# EAGLE design Atmega project_v2 (EAGLE 9.6.2)
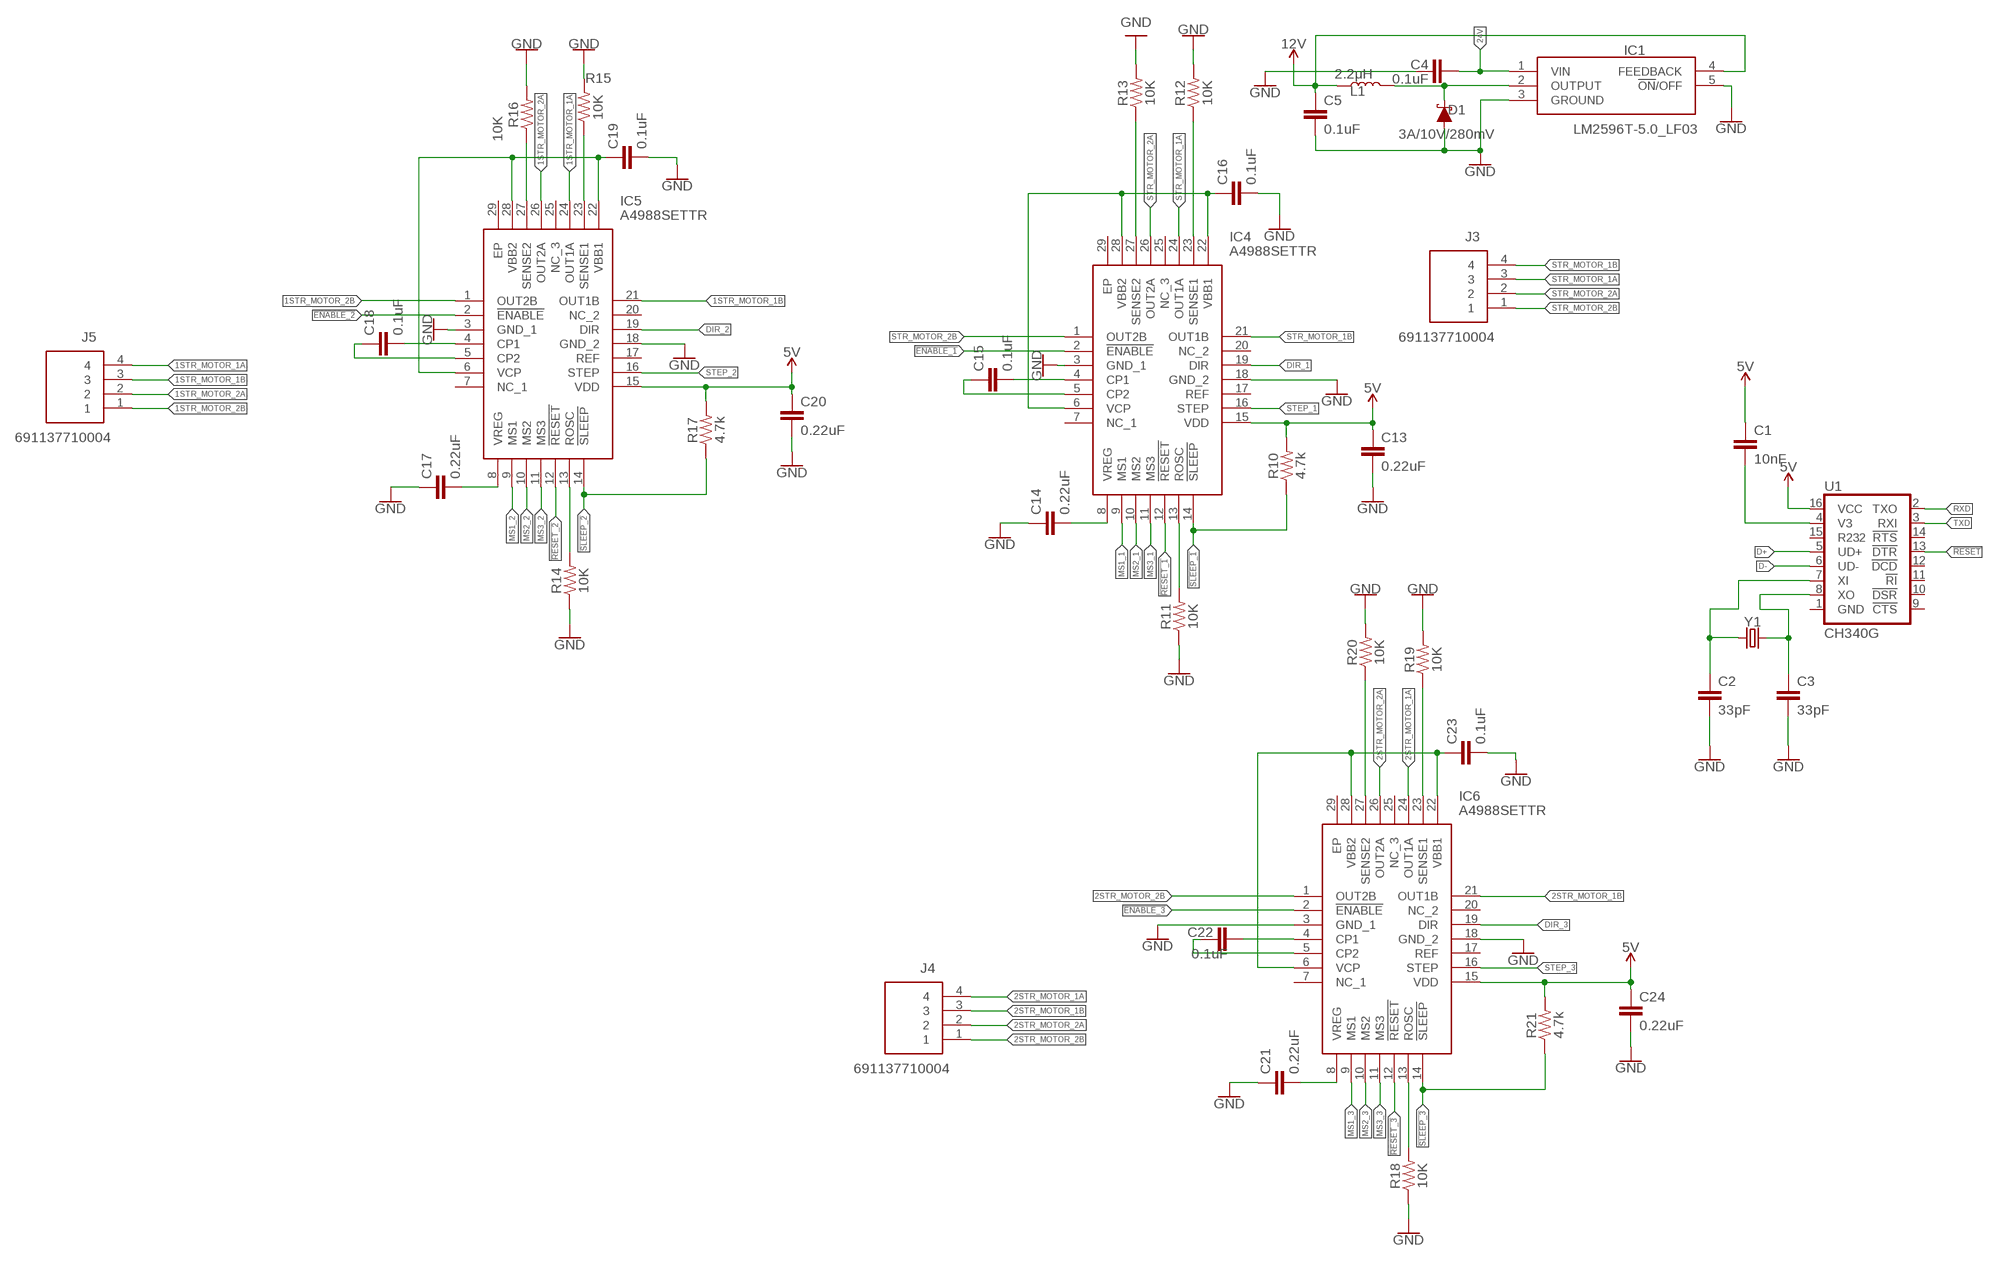
[diagram p0: schematic, sheet 1, part 1 of 2]
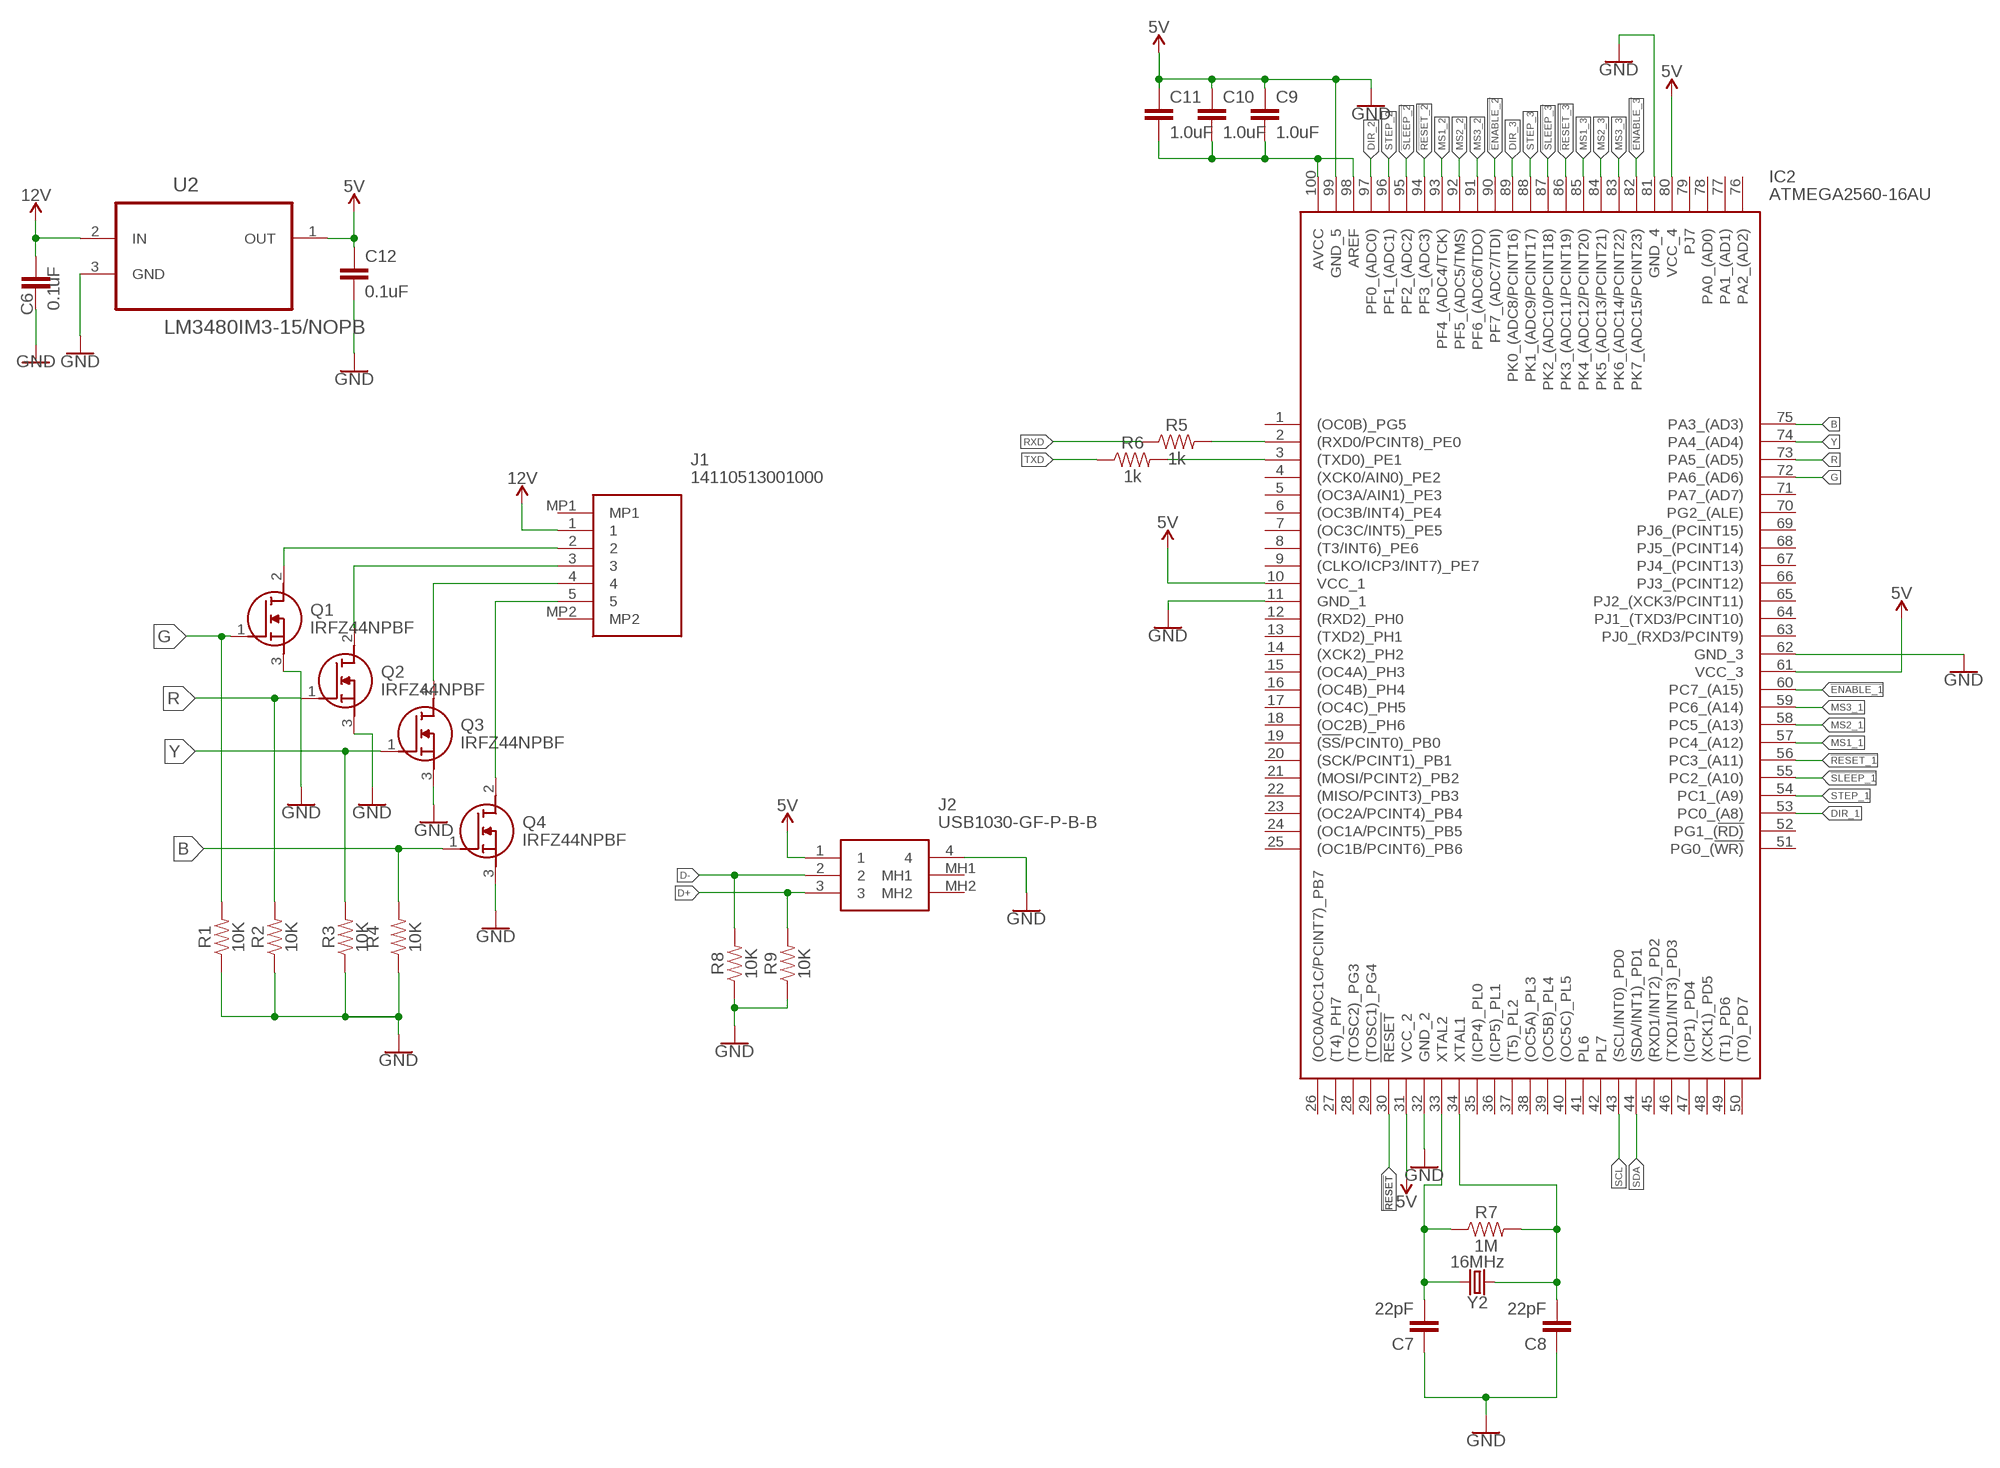
[diagram p1: schematic, sheet 1, part 2 of 2]

## Parts
C1  10nF  10NF-0402T-25V-10%  [0402-TIGHT]
C2  33pF  33PF-0402T-50V-5%  [0402-TIGHT]
C3  33pF  33PF-0402T-50V-5%  [0402-TIGHT]
C4  0.1uF  0.1UF-0603-25V-5%  [0603]
C5  0.1uF  0.1UF-0402T-16V-10%  [0402-TIGHT]
C6  0.1uF  0.1UF-0402T-16V-10%  [0402-TIGHT]
C7  22pF  22PF-0402T-16V-10%  [0402-TIGHT]
C8  22pF  22PF-0402T-16V-10%  [0402-TIGHT]
C9  1.0uF  1.0UF-0402T-16V-10%  [0402-TIGHT]
C10  1.0uF  1.0UF-0402T-16V-10%  [0402-TIGHT]
C11  1.0uF  1.0UF-0402T-16V-10%  [0402-TIGHT]
C12  0.1uF  0.1UF-0402T-6.3V-10%-X7R  [0402-TIGHT]
C13  0.22uF  0.22UF-0402T-10V-10%  [0402-TIGHT]
C14  0.22uF  0.22UF-0402T-10V-10%  [0402-TIGHT]
C15  0.1uF  0.1UF-0402T-10V-10%-X7R  [0402-TIGHT]
C16  0.1uF  0.1UF-0402T-10V-10%-X7R  [0402-TIGHT]
C17  0.22uF  0.22UF-0402T-10V-10%  [0402-TIGHT]
C18  0.1uF  0.1UF-0402T-10V-10%-X7R  [0402-TIGHT]
C19  0.1uF  0.1UF-0402T-10V-10%-X7R  [0402-TIGHT]
C20  0.22uF  0.22UF-0402T-10V-10%  [0402-TIGHT]
C21  0.22uF  0.22UF-0402T-10V-10%  [0402-TIGHT]
C22  0.1uF  0.1UF-0402T-10V-10%-X7R  [0402-TIGHT]
C23  0.1uF  0.1UF-0402T-10V-10%-X7R  [0402-TIGHT]
C24  0.22uF  0.22UF-0402T-10V-10%  [0402-TIGHT]
D1  3A/10V/280mV  DIODE-SCHOTTKY-BAT60A  [SOD-323]
IC1  LM2596T-5.0_LF03  [TO170P470X1028X2142-5P]
IC2  ATMEGA2560-16AU  [QFP50P1600X1600X120-100N]
IC4  A4988SETTR  [QFN50P500X500X100-29N]
IC5  A4988SETTR  [QFN50P500X500X100-29N]
IC6  A4988SETTR  [QFN50P500X500X100-29N]
J1  14110513001000  [14110513001000]
J2  USB1030-GF-P-B-B  [USB1030GFPBB]
J3  691137710004  [691137710004]
J4  691137710004  [691137710004]
J5  691137710004  [691137710004]
L1  2.2μH  2.2μH-0805_WIDE-2.2μH-1.7A-0.14OHM  [0805-WIDE]
Q1  IRFZ44NPBF  [TO254P483X1016X1994-3P]
Q2  IRFZ44NPBF  [TO254P483X1016X1994-3P]
Q3  IRFZ44NPBF  [TO254P483X1016X1994-3P]
Q4  IRFZ44NPBF  [TO254P483X1016X1994-3P]
R1  10K  10KOHM-0402-1/10W-0.1%  [0402-TIGHT]
R2  10K  10KOHM-0402-1/10W-0.1%  [0402-TIGHT]
R3  10K  10KOHM-0402-1/10W-0.1%  [0402-TIGHT]
R4  10K  10KOHM-0402-1/10W-0.1%  [0402-TIGHT]
R5  1k  1KOHM-0402T-1/16W-1%  [0402-TIGHT]
R6  1k  1KOHM-0402T-1/16W-1%  [0402-TIGHT]
R7  1M  1MOHM-0402T-1/16W-5%  [0402-TIGHT]
R8  10K  10KOHM-0402-1/10W-0.1%  [0402-TIGHT]
R9  10K  10KOHM-0402-1/10W-0.1%  [0402-TIGHT]
R10  4.7k  4.7KOHM-0402T-1/16W-1%  [0402-TIGHT]
R11  10K  10KOHM-0402-1/10W-0.1%  [0402-TIGHT]
R12  10K  10KOHM-0402-1/10W-0.1%  [0402-TIGHT]
R13  10K  10KOHM-0402-1/10W-0.1%  [0402-TIGHT]
R14  10K  10KOHM-0402-1/10W-0.1%  [0402-TIGHT]
R15  10K  10KOHM-0402-1/10W-0.1%  [0402-TIGHT]
R16  10K  10KOHM-0402-1/10W-0.1%  [0402-TIGHT]
R17  4.7k  4.7KOHM-0402T-1/16W-1%  [0402-TIGHT]
R18  10K  10KOHM-0402-1/10W-0.1%  [0402-TIGHT]
R19  10K  10KOHM-0402-1/10W-0.1%  [0402-TIGHT]
R20  10K  10KOHM-0402-1/10W-0.1%  [0402-TIGHT]
R21  4.7k  4.7KOHM-0402T-1/16W-1%  [0402-TIGHT]
U1  CH340G  CH340GSMD  [SO016]
U2  LM3480IM3-15/NOPB  [SOT95P251X112-3N]
Y1  CRYSTAL-12MHZ  [CRYSTAL-SMD-2X2.5MM]
Y2  16MHz  CRYSTAL-16MHZSMD-5X3.2  [CRYSTAL-SMD-5X3.2-4PAD]

## Nets
1STR_MOTOR_1A: IC5.24(OUT1A) J5.4
1STR_MOTOR_1B: J5.3
1STR_MOTOR_2A: IC5.26(OUT2A) J5.2
1STR_MOTOR_2B: IC5.1(OUT2B) J5.1
2STR_MOTOR_1A: IC6.24(OUT1A) J4.4
2STR_MOTOR_1B: J4.3
2STR_MOTOR_2A: IC6.26(OUT2A) J4.2
2STR_MOTOR_2B: IC6.1(OUT2B) J4.1
5V: C1.1 C9.1 C10.1 C11.1 C12.1 C13.1 C20.1 C24.1 IC2.10(VCC_1) IC2.31(VCC_2) IC2.61(VCC_3) IC2.80(VCC_4) IC2.99(GND_5) IC4.15(VDD) J2.1 R10.2 R17.2 R21.2 U1.16(VCC) U2.1(OUT) ; supply symbol labelled GND
5V1: IC5.15(VDD)
5V2: IC6.15(VDD)
12V: C5.1 C6.2 IC1.4(FEEDBACK) J1.1 L1.1 U2.2(IN)
24V: C4.2 IC1.1(VIN)
!ENABLE_1: IC2.60(PC7_(A15)) IC4.2(!ENABLE)
!ENABLE_2: IC2.90(PF7_(ADC7/TDI)) IC5.2(!ENABLE)
!ENABLE_3: IC2.82(PK7_(ADC15/PCINT23)) IC6.2(!ENABLE)
!RESET: IC2.30(!RESET) U1.13(!DTR)
!RESET_1: IC2.56(PC3_(A11)) IC4.12(!RESET)
!RESET_2: IC2.94(PF3_(ADC3)) IC5.12(!RESET)
!RESET_3: IC2.86(PK3_(ADC11/PCINT19)) IC6.12(!RESET)
!SLEEP_1: IC2.55(PC2_(A10)) IC4.14(!SLEEP) R10.1
!SLEEP_2: IC2.95(PF2_(ADC2)) IC5.14(!SLEEP) R17.1 R21.1
!SLEEP_3: IC2.87(PK2_(ADC10/PCINT18)) IC6.14(!SLEEP)
B: IC2.75(PA3_(AD3)) Q4.1(G) R4.2
D+: J2.3 R9.2 U1.5(UD+)
D-: J2.2 R8.2 U1.6(UD-)
DIR_1: IC2.53(PC0_(A8)) IC4.19(DIR)
DIR_2: IC2.97(PF0_(ADC0)) IC5.19(DIR) IC6.19(DIR)
DIR_3: IC2.89(PK0_(ADC8/PCINT16))
G: IC2.72(PA6_(AD6)) Q1.1(G) R1.2
GND: C2.2 C3.2 C4.1 C5.2 C6.1 C7.1 C8.1 C12.2 C13.2 C14.1 C16.2 C17.1 C19.2 C20.2 C21.1 C23.2 C24.2 D1.A IC1.3(GROUND) IC1.5(!ON!/OFF) IC2.11(GND_1) IC2.32(GND_2) IC2.62(GND_3) IC2.81(GND_4) IC4.3(GND_1) IC4.18(GND_2) IC5.3(GND_1) IC5.18(GND_2) IC6.3(GND_1) IC6.18(GND_2) J2.4 Q1.3(S) Q2.3(S) Q3.3(S) Q4.3(S) R1.1 R2.1 R3.1 R4.1 R8.1 R9.1 R11.1 R12.2 R13.2 R14.1 R15.2 R16.2 R18.1 R19.2 R20.2 U2.3(GND)
MS1_1: IC2.57(PC4_(A12)) IC4.9(MS1)
MS1_2: IC2.93(PF4_(ADC4/TCK)) IC5.9(MS1)
MS1_3: IC2.85(PK4_(ADC12/PCINT20)) IC6.9(MS1)
MS2_1: IC2.58(PC5_(A13)) IC4.10(MS2)
MS2_2: IC2.92(PF5_(ADC5/TMS)) IC5.10(MS2)
MS2_3: IC2.84(PK5_(ADC13/PCINT21)) IC6.10(MS2)
MS3_1: IC2.59(PC6_(A14)) IC4.11(MS3)
MS3_2: IC2.91(PF6_(ADC6/TDO)) IC5.11(MS3)
MS3_3: IC2.83(PK6_(ADC14/PCINT22)) IC6.11(MS3)
N$1: C1.2 U1.4(V3)
N$2: J1.2 Q1.2(D)
N$3: J1.3 Q2.2(D)
N$4: J1.4 Q3.2(D)
N$5: J1.5 Q4.2(D)
N$6: C2.1 U1.7(XI) Y1.P1
N$7: C3.1 U1.8(XO) Y1.P3
N$8: C8.2 IC2.34(XTAL1) R7.2 Y2.1
N$9: C7.2 IC2.33(XTAL2) R7.1 Y2.3
N$11: C9.2 C10.2 C11.2 IC2.98(AREF) IC2.100(AVCC)
N$13: C14.2 IC4.8(VREG)
N$14: C15.2 IC4.4(CP1)
N$15: IC4.13(ROSC) R11.2
N$16: C15.1 IC4.5(CP2)
N$17: C16.1 IC4.6(VCP) IC4.22(VBB1) IC4.28(VBB2)
N$18: D1.C IC1.2(OUTPUT) L1.2
N$19: C21.2 IC6.8(VREG)
N$20: IC6.13(ROSC) R18.2
N$21: IC4.23(SENSE1) R12.1
N$22: IC4.27(SENSE2) R13.1
N$23: C22.2 IC6.4(CP1)
N$24: C22.1 IC6.5(CP2)
N$25: C17.2 IC5.8(VREG)
N$26: IC5.13(ROSC) R14.2
N$27: C18.2 IC5.4(CP1)
N$28: C18.1 IC5.5(CP2)
N$29: C19.1 IC5.6(VCP) IC5.22(VBB1) IC5.28(VBB2)
N$30: IC5.23(SENSE1) R15.1
N$31: IC5.27(SENSE2) R16.1
N$32: C23.1 IC6.6(VCP) IC6.22(VBB1) IC6.28(VBB2)
N$33: IC6.23(SENSE1) R19.1
N$34: IC6.27(SENSE2) R20.1
R: IC2.73(PA5_(AD5)) Q2.1(G) R2.2
RXD: IC2.2((RXD0/PCINT8)_PE0) R5.1 R5.2 U1.2(TXO)
SCL: IC2.43((SCL/INT0)_PD0)
SDA: IC2.44((SDA/INT1)_PD1)
STEP_1: IC2.54(PC1_(A9)) IC4.16(STEP)
STEP_2: IC2.96(PF1_(ADC1)) IC5.16(STEP) IC6.16(STEP)
STEP_3: IC2.88(PK1_(ADC9/PCINT17))
STR_MOTOR_1A: IC4.24(OUT1A) J3.3
STR_MOTOR_1B: IC4.21(OUT1B) J3.4
STR_MOTOR_1B1: IC5.21(OUT1B)
STR_MOTOR_1B2: IC6.21(OUT1B)
STR_MOTOR_2A: IC4.26(OUT2A) J3.2
STR_MOTOR_2B: IC4.1(OUT2B) J3.1
TXD: IC2.3((TXD0)_PE1) R6.1 R6.2 U1.3(RXI)
Y: IC2.74(PA4_(AD4)) Q3.1(G) R3.2
Unconnected: IC2.1((OC0B)_PG5) IC2.4((XCK0/AIN0)_PE2) IC2.5((OC3A/AIN1)_PE3) IC2.6((OC3B/INT4)_PE4) IC2.7((OC3C/INT5)_PE5) IC2.8((T3/INT6)_PE6) IC2.9((CLKO/ICP3/INT7)_PE7) IC2.12((RXD2)_PH0) IC2.13((TXD2)_PH1) IC2.14((XCK2)_PH2) IC2.15((OC4A)_PH3) IC2.16((OC4B)_PH4) IC2.17((OC4C)_PH5) IC2.18((OC2B)_PH6) IC2.19((!SS!/PCINT0)_PB0) IC2.20((SCK/PCINT1)_PB1) IC2.21((MOSI/PCINT2)_PB2) IC2.22((MISO/PCINT3)_PB3) IC2.23((OC2A/PCINT4)_PB4) IC2.24((OC1A/PCINT5)_PB5) IC2.25((OC1B/PCINT6)_PB6) IC2.26((OC0A/OC1C/PCINT7)_PB7) IC2.27((T4)_PH7) IC2.28((TOSC2)_PG3) IC2.29((TOSC1)_PG4) IC2.35((ICP4)_PL0) IC2.36((ICP5)_PL1) IC2.37((T5)_PL2) IC2.38((OC5A)_PL3) IC2.39((OC5B)_PL4) IC2.40((OC5C)_PL5) IC2.41(PL6) IC2.42(PL7) IC2.45((RXD1/INT2)_PD2) IC2.46((TXD1/INT3)_PD3) IC2.47((ICP1)_PD4) IC2.48((XCK1)_PD5) IC2.49((T1)_PD6) IC2.50((T0)_PD7) IC2.51(PG0_(!WR)) IC2.52(PG1_(!RD)) IC2.63(PJ0_(RXD3/PCINT9)) IC2.64(PJ1_(TXD3/PCINT10)) IC2.65(PJ2_(XCK3/PCINT11)) IC2.66(PJ3_(PCINT12)) IC2.67(PJ4_(PCINT13)) IC2.68(PJ5_(PCINT14)) IC2.69(PJ6_(PCINT15)) IC2.70(PG2_(ALE)) IC2.71(PA7_(AD7)) IC2.76(PA2_(AD2)) IC2.77(PA1_(AD1)) IC2.78(PA0_(AD0)) IC2.79(PJ7) IC4.7(NC_1) IC4.17(REF) IC4.20(NC_2) IC4.25(NC_3) IC4.29(EP) IC5.7(NC_1) IC5.17(REF) IC5.20(NC_2) IC5.25(NC_3) IC5.29(EP) IC6.7(NC_1) IC6.17(REF) IC6.20(NC_2) IC6.25(NC_3) IC6.29(EP) J1.MP1 J1.MP2 J2.MH1 J2.MH2 U1.1(GND) U1.9(!CTS) U1.10(!DSR) U1.11(!RI) U1.12(!DCD) U1.14(!RTS) U1.15(R232)

## Library data of the parts
C1 = SparkFun-Capacitors:10NF: 0.01uF/10nF/10,000pF ceramic capacitors A capacitor is a passive two-terminal electrical component used to store electrical energy temporarily in an electric field. CAP-09321; PROD_ID: CAP-14847
C2 C3 = SparkFun-Capacitors:33PF: 33pF ceramic capacitors A capacitor is a passive two-terminal electrical component used to store electrical energy temporarily in an electric field.; PROD_ID: CAP-15358
C4 = SparkFun-Capacitors:0.1UF: 0.1µF ceramic capacitors A capacitor is a passive two-terminal electrical component used to store electrical energy temporarily in an electric field.; PROD_ID: CAP-08604
C5 C6 = SparkFun-Capacitors:0.1UF: 0.1µF ceramic capacitors A capacitor is a passive two-terminal electrical component used to store electrical energy temporarily in an electric field.; PROD_ID: CAP-12416
C7 C8 = SparkFun-Capacitors:22PF: 22pF ceramic capacitors A capacitor is a passive two-terminal electrical component used to store electrical energy temporarily in an electric field.; PROD_ID: CAP-14674
C9-C11 = SparkFun-Capacitors:1.0UF: 1µF ceramic capacitors A capacitor is a passive two-terminal electrical component used to store electrical energy temporarily in an electric field.; PROD_ID: CAP-12417
C12 = SparkFun-Capacitors:0.1UF: 0.1µF ceramic capacitors A capacitor is a passive two-terminal electrical component used to store electrical energy temporarily in an electric field.; PROD_ID: CAP-14993
C13 C14 C17 C20 C21 C24 = SparkFun-Capacitors:0.22UF: 0.22µF ceramic capacitors A capacitor is a passive two-terminal electrical component used to store electrical energy temporarily in an electric field.; PROD_ID: CAP-14846
C15 C16 C18 C19 C22 C23 = SparkFun-Capacitors:0.1UF: 0.1µF ceramic capacitors A capacitor is a passive two-terminal electrical component used to store electrical energy temporarily in an electric field.; PROD_ID: CAP-15083
D1 = SparkFun-DiscreteSemi:DIODE-SCHOTTKY: Schottky diode A Schottky diode is a semiconductor diode which has a low forward voltage drop and a very fast switching action.; PROD_ID: DIO-14072
IC1 = LM2596T-5.0_LF03:LM2596T-5.0_LF03: SIMPLE SWITCHER 4.5V to 40V, 3A Low Component Count Step-Down Regulator Source: Datasheet <https://www.ti.com/lit/ds/symlink/lm2596.pdf?ts=1607069798907&ref_url=https%3A%2F%2Fwww.ti.com%2Fstore%2Fti%2Fen%2Fp%2Fproduct%2F%3Fp%3DLM2596T-5.0%2FLF03%26keyMatch%3DLM2596T-5.0%2FLF03%26tisearch%3DSearch-EN-everything%>; ARROW_PART_NUMBER: LM2596T-5.0/LF03; ARROW_PRICE-STOCK: https://www.arrow.com/en/products/lm2596t-5.0lf03/texas-instruments?region=nac; DESCRIPTION: SIMPLE SWITCHER 4.5V to 40V, 3A Low Component Count Step-Down Regulator; HEIGHT: 4.7mm; MANUFACTURER_NAME: Texas Instruments; MANUFACTURER_PART_NUMBER: LM2596T-5.0/LF03; MOUSER_PART_NUMBER: 926-LM2596T-50/LF03; MOUSER_PRICE-STOCK: https://www.mouser.co.uk/ProductDetail/Texas-Instruments/LM2596T-50-LF03?qs=X1J7HmVL2ZG6KM98hB9zGA%3D%3D
IC2 = ATMEGA2560-16AU:ATMEGA2560-16AU: ATMEGA2560-16AU, 8 bit AVR Microcontroller 16MHz 4, 256kb Flash, 8kb RAM, I2C SPI 100-Pin TQFP Source: Datasheet <https://datasheet.datasheetarchive.com/originals/distributors/Datasheets_SAMA/4a5a397fa76c39b5297f4121ace1d84e.pdf>; ARROW_PART_NUMBER: ATMEGA2560-16AU; ARROW_PRICE-STOCK: https://www.arrow.com/en/products/atmega2560-16au/microchip-technology?region=nac; DESCRIPTION: ATMEGA2560-16AU, 8 bit AVR Microcontroller 16MHz 4, 256kb Flash, 8kb RAM, I2C SPI 100-Pin TQFP; HEIGHT: 1.2mm; MANUFACTURER_NAME: Microchip; MANUFACTURER_PART_NUMBER: ATMEGA2560-16AU; MOUSER_PART_NUMBER: 556-ATMEGA2560-16AU; MOUSER_PRICE-STOCK: https://www.mouser.co.uk/ProductDetail/Microchip-Technology-Atmel/ATMEGA2560-16AU?qs=aqrrBurbvGciYmlAokFS0w%3D%3D
IC4-IC6 = A4988SETTR:A4988SETTR: Allegro Microsystems A4988SETTR, Stepper Motor Driver IC, 35 V +/-2A 28-Pin, QFN Source: Datasheet <https://www.allegromicro.com/~/media/Files/Datasheets/A4988-Datasheet.ashx>; DESCRIPTION: Allegro Microsystems A4988SETTR, Stepper Motor Driver IC, 35 V +/-2A 28-Pin, QFN; HEIGHT: 1mm; MANUFACTURER_NAME: Allegro Microsystems; MANUFACTURER_PART_NUMBER: A4988SETTR
J1 = 14110513001000:14110513001000: 5 contacts Vertical mount SMT Source: Datasheet <https://b2b.harting.com/files/download/PRD/PDF_TS/1411XX13001XXX_100228421DRW046C.pdf>; ARROW_PART_NUMBER: 14110513001000; ARROW_PRICE-STOCK: https://www.arrow.com/en/products/14110513001000/harting; DESCRIPTION: 5 contacts Vertical mount SMT; HEIGHT: 7.45mm; MANUFACTURER_NAME: HARTING; MANUFACTURER_PART_NUMBER: 14110513001000; MOUSER_PART_NUMBER: 617-14110513001000; MOUSER_PRICE-STOCK: https://www.mouser.co.uk/ProductDetail/HARTING/14110513001000?qs=9nYkJLYMUzvq4GdFieWOAA%3D%3D
J2 = USB1030-GF-P-B-B:USB1030-GF-P-B-B: USB Connectors USB B Skt, Top TH, R/A, GF, Wth kinked shell stake, tray Source: Datasheet <https://gct.co/files/drawings/usb1030.pdf?v=6f3e53a4-19ab-41a0-8ac3-960e4d6fce65>; DESCRIPTION: USB Connectors USB B Skt, Top TH, R/A, GF, Wth kinked shell stake, tray; HEIGHT: 11.2mm; MANUFACTURER_NAME: GCT (GLOBAL CONNECTOR TECHNOLOGY); MANUFACTURER_PART_NUMBER: USB1030-GF-P-B-B; MOUSER_PART_NUMBER: 640-USB1030-GF-P-B-B; MOUSER_PRICE-STOCK: https://www.mouser.co.uk/ProductDetail/GCT/USB1030-GF-P-B-B?qs=KUoIvG%2F9Ila4yhPpaOZhHA%3D%3D
J3-J5 = 691137710004:691137710004: Wurth Elektronik, WR-TBL 5mm Pitch, 4 Way PCB Terminal Block Source: Datasheet <https://www.we-online.com/catalog/datasheet/691137710004.pdf>; DESCRIPTION: Wurth Elektronik, WR-TBL 5mm Pitch, 4 Way PCB Terminal Block; HEIGHT: 11.6mm; MANUFACTURER_NAME: Wurth Elektronik; MANUFACTURER_PART_NUMBER: 691137710004; MOUSER_PART_NUMBER: 710-691137710004; MOUSER_PRICE-STOCK: https://www.mouser.co.uk/ProductDetail/Wurth-Elektronik/691137710004?qs=lBTPRtX1sU%2F%2FMst6RmLNCA%3D%3D
L1 = SparkFun-Coils:2.2μH: 2.2μH Inductor Resist changes in electrical current. Basically a coil of wire. SparkFun Products: SparkFun Edge - HX711 <https://www.sparkfun.com/products/15170>; PROD_ID: NDUC-14234
Q1-Q4 = IRFZ44NPBF:IRFZ44NPBF: MOSFET N-Channel 55V 49A TO220AB Infineon IRFZ44NPBF N-channel MOSFET Transistor, 49 A, 55 V, 3-Pin TO-220AB Source: Datasheet <https://www.infineon.com/dgdl/irfz44npbf.pdf?fileId=5546d462533600a40153563b3a9f220d>; ARROW_PART_NUMBER: IRFZ44NPBF; ARROW_PRICE-STOCK: https://www.arrow.com/en/products/irfz44npbf/infineon-technologies-ag?region=nac; DESCRIPTION: MOSFET N-Channel 55V 49A TO220AB Infineon IRFZ44NPBF N-channel MOSFET Transistor, 49 A, 55 V, 3-Pin TO-220AB; HEIGHT: 4.83mm; MANUFACTURER_NAME: Infineon; MANUFACTURER_PART_NUMBER: IRFZ44NPBF; MOUSER_PART_NUMBER: 942-IRFZ44NPBF; MOUSER_PRICE-STOCK: https://www.mouser.co.uk/ProductDetail/Infineon-IR/IRFZ44NPBF?qs=9%252BKlkBgLFf24zghzPg2f9g%3D%3D
R1-R4 R8 R9 R11-R16 R18-R20 = SparkFun-Resistors:10KOHM: 10kΩ resistor A resistor is a passive two-terminal electrical component that implements electrical resistance as a circuit element. Resistors act to reduce current flow, and, at the same time, act to lower voltage levels within circuits. - Wikipedia; PROD_ID: RES-16147
R5 R6 = SparkFun-Resistors:1KOHM: 1kΩ resistor A resistor is a passive two-terminal electrical component that implements electrical resistance as a circuit element. Resistors act to reduce current flow, and, at the same time, act to lower voltage levels within circuits. - Wikipedia; PROD_ID: RES-14342
R7 = SparkFun-Resistors:1MOHM: 1MΩ resistor A resistor is a passive two-terminal electrical component that implements electrical resistance as a circuit element. Resistors act to reduce current flow, and, at the same time, act to lower voltage levels within circuits. - Wikipedia; PROD_ID: RES-15185
R10 R17 R21 = SparkFun-Resistors:4.7KOHM: 4.7kΩ resistor A resistor is a passive two-terminal electrical component that implements electrical resistance as a circuit element. Resistors act to reduce current flow, and, at the same time, act to lower voltage levels within circuits. - Wikipedia; PROD_ID: RES-15343
U1 = SparkFun-IC-Comms:CH340G: A simple USB 2.0 to Serial IC.; PROD_ID: IC-13498
U2 = LM3480IM3-15_NOPB:LM3480IM3-15/NOPB: Low-Dropout Linear Voltage Check availability <https://pricing.snapeda.com/parts/LM3480IM3-15/NOPB/Texas%20Instruments/view-part?ref=eda>; AVAILABILITY: In Stock; DESCRIPTION: 100-mA, 30-V, low-dropout voltage regulator; MF: Texas Instruments; MP: LM3480IM3-15/NOPB; PACKAGE: SOT-23-3 Texas Instruments; PRICE: None; PURCHASE-URL: https://pricing.snapeda.com/search/part/LM3480IM3-15/NOPB/?ref=eda
Y1 = SparkFun-Clocks:CRYSTAL-12MHZ: 12.0MHz Crystal Frequency: 12.0MHz Frequency Tolerance: ±20ppm Load Capacitance: 18pF SparkFun Products: SparkFun Logomatic <https://www.sparkfun.com/products/12772> Pocket AVR Programmer <https://www.sparkfun.com/products/9825>; PROD_ID: XTAL-15540
Y2 = SparkFun-Clocks:CRYSTAL-16MHZ: 16MHz Crystal Digikey Example <http://www.digikey.com/product-search/en?keywords=535-9122-1-ND> Frequency: 16MHz Frequency Stability: ±50ppm Frequency Tolerance: ±20ppm Load Capacitance: 18pF SparkFun Products: Pro Micro -5V/16MHz <https://www.sparkfun.com/products/12640> SparkFun Serial Enabled LCD Kit <https://www.sparkfun.com/products/10097>; PROD_ID: XTAL-08218; SF_ID: COM-00094

## Board
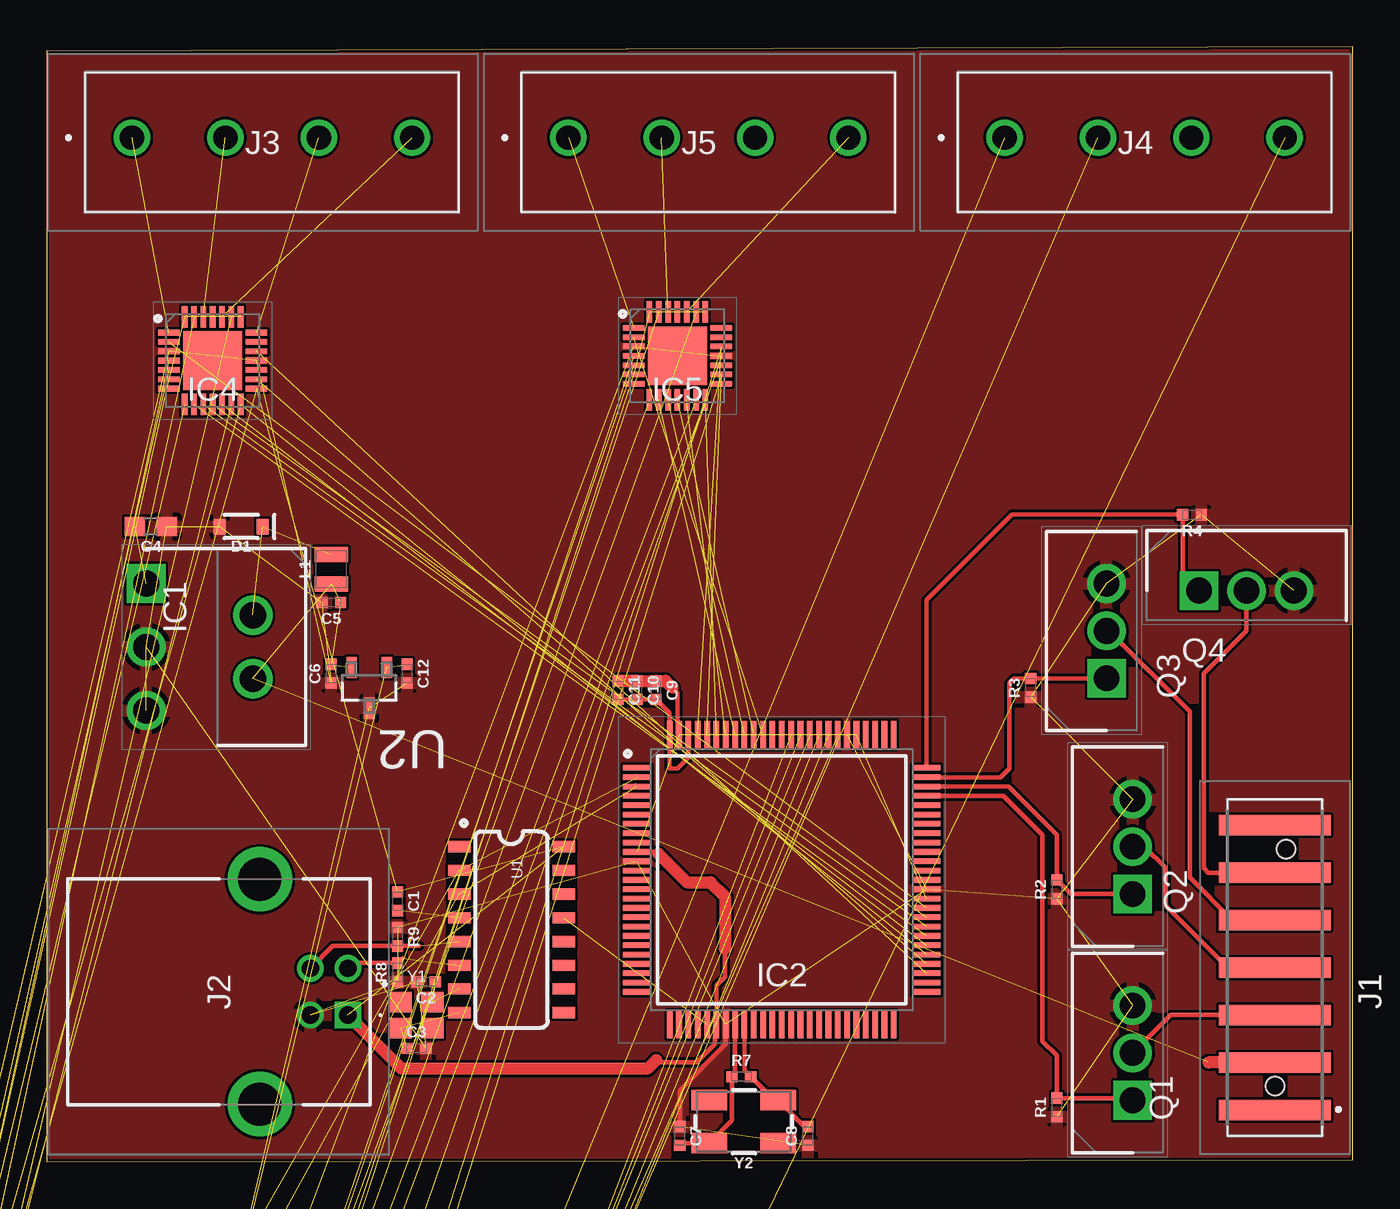
[diagram p2: board, top side]
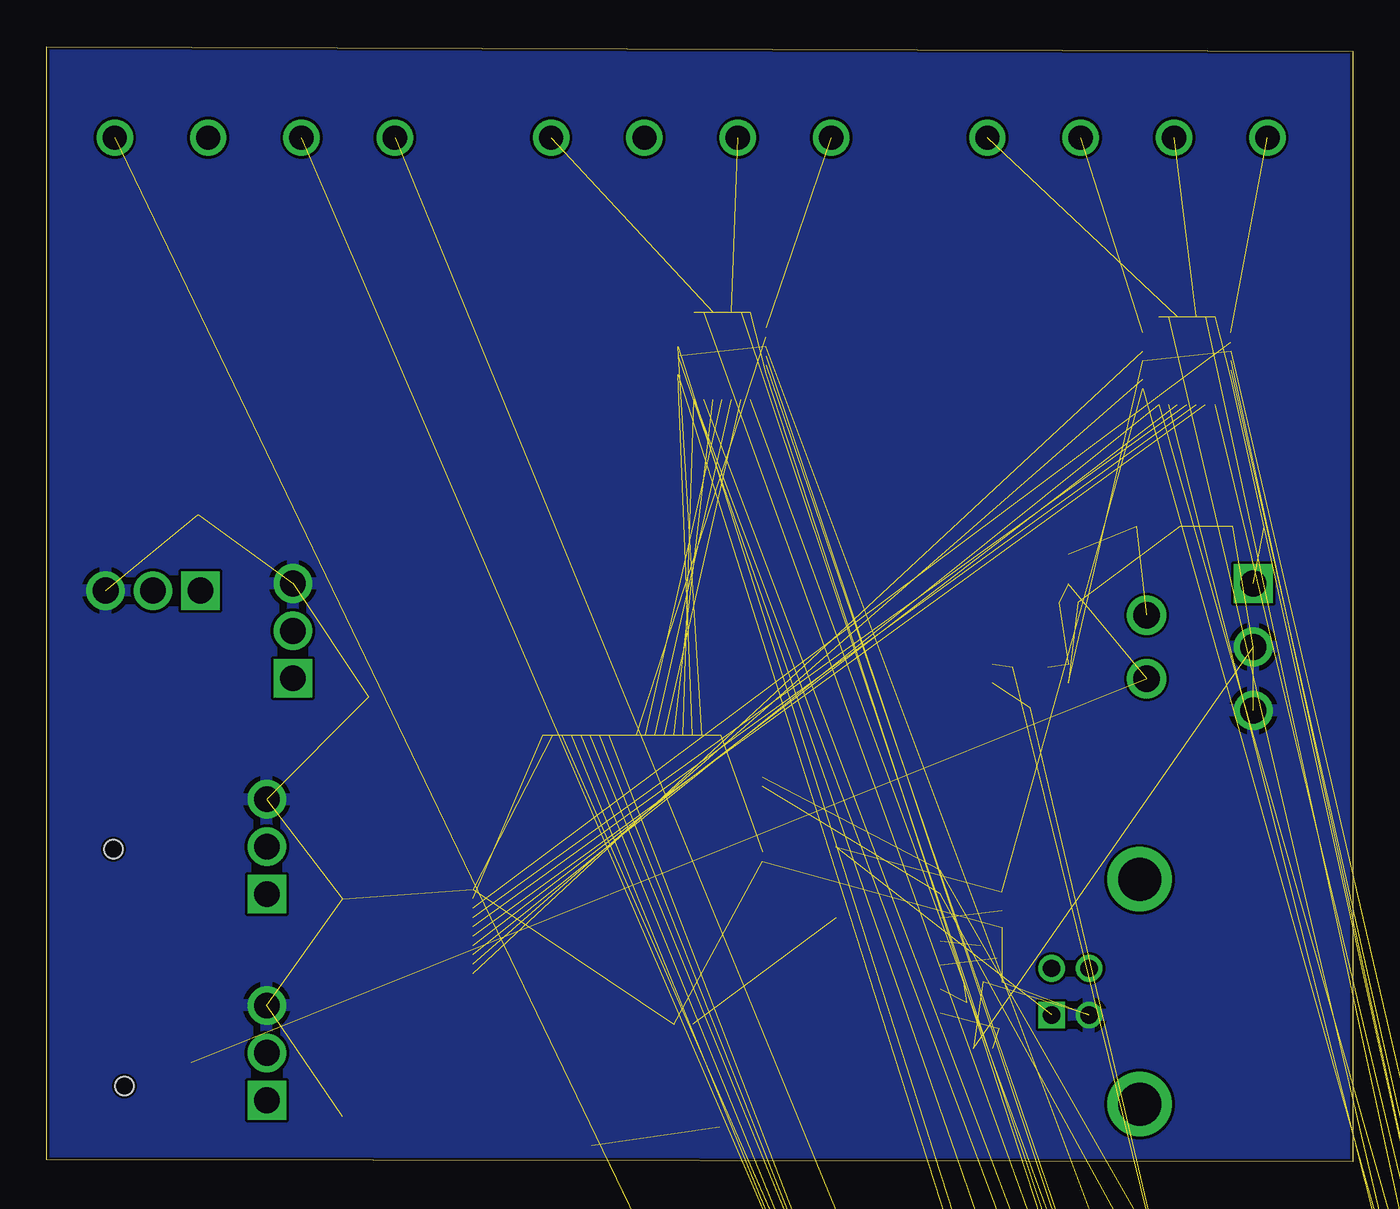
[diagram p3: board, bottom side, seen from below]

Size 69.96 x 59.74 mm. Coordinates in mm from the lower left corner, seen from the top.
Outline: 0,0 69.96,0.13 69.96,59.74 0,59.49 0,0
Copper layers (1*16): Top 0.035mm / dielectric 1.5mm / Bottom 0.035mm
Design rules "default *": minimum track width 6mil, minimum drill 0.35mm, track to track 6mil, track to pad 6mil, pad to pad 6mil, via to via 6mil, smd to smd 6mil, copper to edge 6mil, drill to drill 6mil, minimum pad ring 10mil, minimum via ring 8mil, stop-mask expansion 4mil, vias tented up to drill 0mil, thermal gap 10mil

### Footprints (pad centres in the part's own frame; a part is rotated, then mirrored left to right if it is on the bottom)
0402-TIGHT = smd 0.6 x 0.6: 1 -0.5,0; 2 0.5,0
0603 = smd 1.1 x 1: 1 -0.85,0; 2 0.85,0
SOD-323 = smd 0.63 x 0.83: A 1.15,0; C -1.15,0
TO170P470X1028X2142-5P = drill 1.4 pad 2.1 square: 1 0,0 | drill 1.4 pad 2.1: 2 1.7,5.71; 3 3.4,0; 4 5.1,5.71; 5 6.8,0
QFP50P1600X1600X120-100N = smd 1.5 x 0.3: 1 -7.75,6; 2 -7.75,5.5; 3 -7.75,5; 4 -7.75,4.5; 5 -7.75,4; 6 -7.75,3.5; 7 -7.75,3; 8 -7.75,2.5; 9 -7.75,2; 10 -7.75,1.5; 11 -7.75,1; 12 -7.75,0.5; 13 -7.75,0; 14 -7.75,-0.5; 15 -7.75,-1; 16 -7.75,-1.5; 17 -7.75,-2; 18 -7.75,-2.5; 19 -7.75,-3; 20 -7.75,-3.5; 21 -7.75,-4; 22 -7.75,-4.5; 23 -7.75,-5; 24 -7.75,-5.5; 25 -7.75,-6; 51 7.75,-6; 52 7.75,-5.5; 53 7.75,-5; 54 7.75,-4.5; 55 7.75,-4; 56 7.75,-3.5; 57 7.75,-3; 58 7.75,-2.5; 59 7.75,-2; 60 7.75,-1.5; 61 7.75,-1; 62 7.75,-0.5; 63 7.75,0; 64 7.75,0.5; 65 7.75,1; 66 7.75,1.5; 67 7.75,2; 68 7.75,2.5; 69 7.75,3; 70 7.75,3.5; 71 7.75,4; 72 7.75,4.5; 73 7.75,5; 74 7.75,5.5; 75 7.75,6 | smd 0.3 x 1.5: 26 -6,-7.75; 27 -5.5,-7.75; 28 -5,-7.75; 29 -4.5,-7.75; 30 -4,-7.75; 31 -3.5,-7.75; 32 -3,-7.75; 33 -2.5,-7.75; 34 -2,-7.75; 35 -1.5,-7.75; 36 -1,-7.75; 37 -0.5,-7.75; 38 0,-7.75; 39 0.5,-7.75; 40 1,-7.75; 41 1.5,-7.75; 42 2,-7.75; 43 2.5,-7.75; 44 3,-7.75; 45 3.5,-7.75; 46 4,-7.75; 47 4.5,-7.75; 48 5,-7.75; 49 5.5,-7.75; 50 6,-7.75; 76 6,7.75; 77 5.5,7.75; 78 5,7.75; 79 4.5,7.75; 80 4,7.75; 81 3.5,7.75; 82 3,7.75; 83 2.5,7.75; 84 2,7.75; 85 1.5,7.75; 86 1,7.75; 87 0.5,7.75; 88 0,7.75; 89 -0.5,7.75; 90 -1,7.75; 91 -1.5,7.75; 92 -2,7.75; 93 -2.5,7.75; 94 -3,7.75; 95 -3.5,7.75; 96 -4,7.75; 97 -4.5,7.75; 98 -5,7.75; 99 -5.5,7.75; 100 -6,7.75
QFN50P500X500X100-29N = smd 1.15 x 0.3: 1 -2.35,1.5; 2 -2.35,1; 3 -2.35,0.5; 4 -2.35,0; 5 -2.35,-0.5; 6 -2.35,-1; 7 -2.35,-1.5; 15 2.35,-1.5; 16 2.35,-1; 17 2.35,-0.5; 18 2.35,0; 19 2.35,0.5; 20 2.35,1; 21 2.35,1.5 | smd 0.3 x 1.15: 8 -1.5,-2.35; 9 -1,-2.35; 10 -0.5,-2.35; 11 0,-2.35; 12 0.5,-2.35; 13 1,-2.35; 14 1.5,-2.35; 22 1.5,2.35; 23 1,2.35; 24 0.5,2.35; 25 0,2.35; 26 -0.5,2.35; 27 -1,2.35; 28 -1.5,2.35 | smd 3.15 x 3.15: 29 0,0
14110513001000 = smd 1.1 x 6: 1 -5.08,0; 2 -2.54,0; 3 0,0; 4 2.54,0; 5 5.08,0; MP1 -7.62,0; MP2 7.62,0 | hole 1: -6.35,0; 6.35,-0.6
USB1030GFPBB = drill 0.92 pad 1.431 square: 1 0,0 | drill 0.92 pad 1.431: 2 -2.5,0; 3 -2.5,-2; 4 0,-2 | drill 2.3 pad 3.45: MH1 4.77,-4.71; MH2 -7.27,-4.71
691137710004 = drill 1.3 pad 1.95: 1 0,0; 2 5,0; 3 10,0; 4 15,0
0805-WIDE = smd 0.8 x 1.8: 1 -0.8,0; 2 0.8,0
TO254P483X1016X1994-3P = drill 1.38 pad 2.07 square: 1 0,0 | drill 1.38 pad 2.07: 2 2.54,0; 3 5.08,0
SO016 = smd 0.6 x 1.2: 1 -4.445,-2.8; 2 -3.175,-2.8; 3 -1.905,-2.8; 4 -0.635,-2.8; 5 0.635,-2.8; 6 1.905,-2.8; 7 3.175,-2.8; 8 4.445,-2.8; 9 4.445,2.8; 10 3.175,2.8; 11 1.905,2.8; 12 0.635,2.8; 13 -0.635,2.8; 14 -1.905,2.8; 15 -3.175,2.8; 16 -4.445,2.8
SOT95P251X112-3N = smd 0.559 x 1.143: 1 -0.94,-1.092; 2 0.94,-1.092; 3 0,1.092
CRYSTAL-SMD-2X2.5MM = smd 1.2 x 1.1: P1 0.846,0.69; P2 -0.854,0.69; P3 -0.854,-0.71; P4 0.846,-0.71
CRYSTAL-SMD-5X3.2-4PAD = smd 1.9 x 1.1: 1 -1.85,-1.15; 2 1.85,-1.15; 3 1.85,1.15; 4 -1.85,1.15

### Placement (x,y rotation side)
C1  18.8,13.97 270 top
C2  20.32,9.65 180 top
C3  19.81,6.1 0 top
C4  5.59,34.04 180 top
C5  15.24,29.97 180 top
C6  15.24,26.16 90 top
C7  33.91,1.4 270 top
C8  40.77,1.4 90 top
C9  32.64,25.27 270 top
C10  31.62,25.27 270 top
C11  30.61,25.27 270 top
C12  19.3,26.16 270 top
C13  -23.37,-82.8 0 top  (outside the outline)
C14  -23.37,-85.85 0 top  (outside the outline)
C15  -23.37,-91.95 0 top  (outside the outline)
C16  -23.37,-95 0 top  (outside the outline)
C17  -23.62,-110.49 0 top  (outside the outline)
C18  -20.57,-110.49 0 top  (outside the outline)
C19  -17.78,-110.49 0 top  (outside the outline)
C20  -23.62,-116.59 0 top  (outside the outline)
C21  -23.62,-129.03 0 top  (outside the outline)
C22  -17.27,-129.03 0 top  (outside the outline)
C23  -23.88,-132.08 0 top  (outside the outline)
C24  -20.32,-129.03 0 top  (outside the outline)
D1  10.41,34.04 180 top
IC1  5.33,30.99 270 top
IC2  39.37,15.11 0 top
IC4  8.89,42.93 0 top
IC5  33.78,43.18 0 top
IC6  -19.3,-124.21 0 top  (outside the outline)
J1  65.79,10.41 90 top
J2  16.13,7.87 270 top
J3  4.57,54.86 0 top
J4  51.31,54.86 0 top
J5  27.94,54.86 0 top
L1  15.24,31.75 90 top
Q1  58.17,3.3 90 top
Q2  58.17,14.35 90 top
Q3  56.77,25.91 90 top
Q4  61.72,30.61 0 top
R1  54.1,2.92 90 top
R2  54.1,14.61 90 top
R3  52.7,25.4 90 top
R4  61.34,34.67 180 top
R5  -3.3,-27.94 0 top  (outside the outline)
R6  -3.3,-30.99 0 top  (outside the outline)
R7  37.21,4.57 0 top
R8  18.8,10.16 90 top
R9  18.8,12.06 270 top
R10  -23.37,-79.76 0 top  (outside the outline)
R11  -23.37,-88.9 0 top  (outside the outline)
R12  -23.37,-98.04 0 top  (outside the outline)
R13  -23.37,-101.09 0 top  (outside the outline)
R14  -24.13,-113.54 0 top  (outside the outline)
R15  -22.1,-113.54 0 top  (outside the outline)
R16  -20.07,-113.54 0 top  (outside the outline)
R17  -24.13,-119.63 0 top  (outside the outline)
R18  -19.05,-132.08 0 top  (outside the outline)
R19  -17.02,-132.08 0 top  (outside the outline)
R20  -14.99,-132.08 0 top  (outside the outline)
R21  -21.34,-132.08 0 top  (outside the outline)
U1  24.89,12.45 270 top
U2  17.27,25.4 180 top
Y1  19.81,7.87 0 top
Y2  37.34,2.16 180 top

### Tracks (layer width: path | path; a pad name or v marks a point on that pad's centre or on a via)
1STR_MOTOR_1A  (1 unrouted)
1STR_MOTOR_2A  (1 unrouted)
1STR_MOTOR_2B  (1 unrouted)
2STR_MOTOR_1A  (1 unrouted)
2STR_MOTOR_2A  (1 unrouted)
2STR_MOTOR_2B  (1 unrouted)
5V  (14 unrouted)
  Top 0.254: IC2.10 32.66,16.61 32.77,16.51 | 32.64,5.46 32.77,5.33 34.81,5.33 35.8,6.32 35.8,7.29 IC2.31 35.87,9.45 36.32,9.91 36.32,11.43 | IC2.99 33.8,22.93 33.8,25.13 33.53,25.4
  Top 0.635: 33.53,25.4 33.16,25.77 C9.1 C11.1 C10.1 | 32.64,5.46 32.17,4.99 19.01,4.99 J2.1 | 32.77,16.51 34.29,14.99 35.56,14.99 36.32,14.22 36.32,11.43
12V  (5 unrouted)
  Top 0.635: J1.1 62.23,5.33
24V  (1 unrouted)
!ENABLE_1  (1 unrouted)
!ENABLE_2  (1 unrouted)
!ENABLE_3  (1 unrouted)
!RESET  (1 unrouted)
!RESET_1  (1 unrouted)
!RESET_2  (1 unrouted)
!RESET_3  (1 unrouted)
!SLEEP_1  (2 unrouted)
!SLEEP_2  (3 unrouted)
!SLEEP_3  (1 unrouted)
B
  Top 0.254: Q4.1 60.84,31.49 R4.2 51.69,34.67 47.12,30.1 IC2.75
D+  (1 unrouted)
  Top 0.254: J2.3 15.32,11.56 R9.2 19.95,11.56
D-  (1 unrouted)
  Top 0.254: J2.2 16.41,10.66 R8.2 19.06,10.92
DIR_1  (1 unrouted)
DIR_2  (2 unrouted)
G
  Top 0.254: Q1.1 58.05,3.42 R1.2 54.1,5.71 53.34,6.47 53.34,17.53 51.25,19.61 IC2.72
GND  (49 unrouted)
  Top 0.254: C7.1 33.91,3.85 36.37,6.31 IC2.32
  pour Bottom: 1.02,65.79 70.87,65.79 78.23,58.42 78.23,1.02 69.09,-8.13 2.54,-8.13 -5.84,0.25 -5.84,58.93
  pour Top: 1.27,65.53 71.37,65.53 78.49,58.42 78.49,-1.02 69.85,-9.65 4.06,-9.65 -5.84,0.25 -5.84,58.42
MS1_1  (1 unrouted)
MS1_2  (1 unrouted)
MS1_3  (1 unrouted)
MS2_1  (1 unrouted)
MS2_2  (1 unrouted)
MS2_3  (1 unrouted)
MS3_1  (1 unrouted)
MS3_2  (1 unrouted)
MS3_3  (1 unrouted)
N$1  (1 unrouted)
N$2
  Top 0.254: Q1.2 60.2,7.87 J1.2
N$3
  Top 0.254: 64.52,10.41 J1.3 63.25,10.41 59.94,13.72 59.94,15.75 58.8,16.89 Q2.2
N$4
  Top 0.254: J1.4 63.5,12.95 61.21,15.24 61.21,24.13 56.9,28.45 Q3.2
N$5
  Top 0.254: Q4.2 64.26,28.45 61.98,26.16 61.98,15.75 62.23,15.49 J1.5
N$6  (2 unrouted)
N$7  (2 unrouted)
N$8
  Top 0.254: 37.35,7.35 IC2.34 37.37,4.91 R7.2 38.97,3.31 Y2.1 40.6,1.9 C8.2
N$9
  Top 0.254: C7.2 34.02,1.01 Y2.3 36.72,2.24 36.72,3.98 36.71,3.98 R7.1 36.87,4.73 IC2.33
N$11
  Top 0.254: IC2.98 34.37,21.67 33.78,21.08 33.37,21.08 IC2.100 33.37,24.04 C9.2 C10.2 C11.2
N$13  (1 unrouted)
N$14  (1 unrouted)
N$15  (1 unrouted)
N$16  (1 unrouted)
N$17  (3 unrouted)
N$18  (2 unrouted)
N$19  (1 unrouted)
N$20  (1 unrouted)
N$21  (1 unrouted)
N$22  (1 unrouted)
N$23  (1 unrouted)
N$24  (1 unrouted)
N$25  (1 unrouted)
N$26  (1 unrouted)
N$27  (1 unrouted)
N$28  (1 unrouted)
N$29  (3 unrouted)
N$30  (1 unrouted)
N$31  (1 unrouted)
N$32  (3 unrouted)
N$33  (1 unrouted)
N$34  (1 unrouted)
R
  Top 0.254: Q2.1 54.86,14.35 R2.2 54.1,17.53 51.52,20.11 IC2.73
RXD  (3 unrouted)
  Top 0.254: IC2.2 31.55,20.68
STEP_1  (1 unrouted)
STEP_2  (2 unrouted)
STR_MOTOR_1A  (1 unrouted)
STR_MOTOR_1B  (1 unrouted)
STR_MOTOR_2A  (1 unrouted)
STR_MOTOR_2B  (1 unrouted)
  Top 0.152: J3.1 4.32,55.12 4.32,55.37
TXD  (3 unrouted)
  Top 0.254: 31.55,20.18 IC2.3
Y
  Top 0.254: Q3.1 R3.2 51.81,25.9 51.56,25.65 51.56,21.08 51.09,20.61 IC2.74